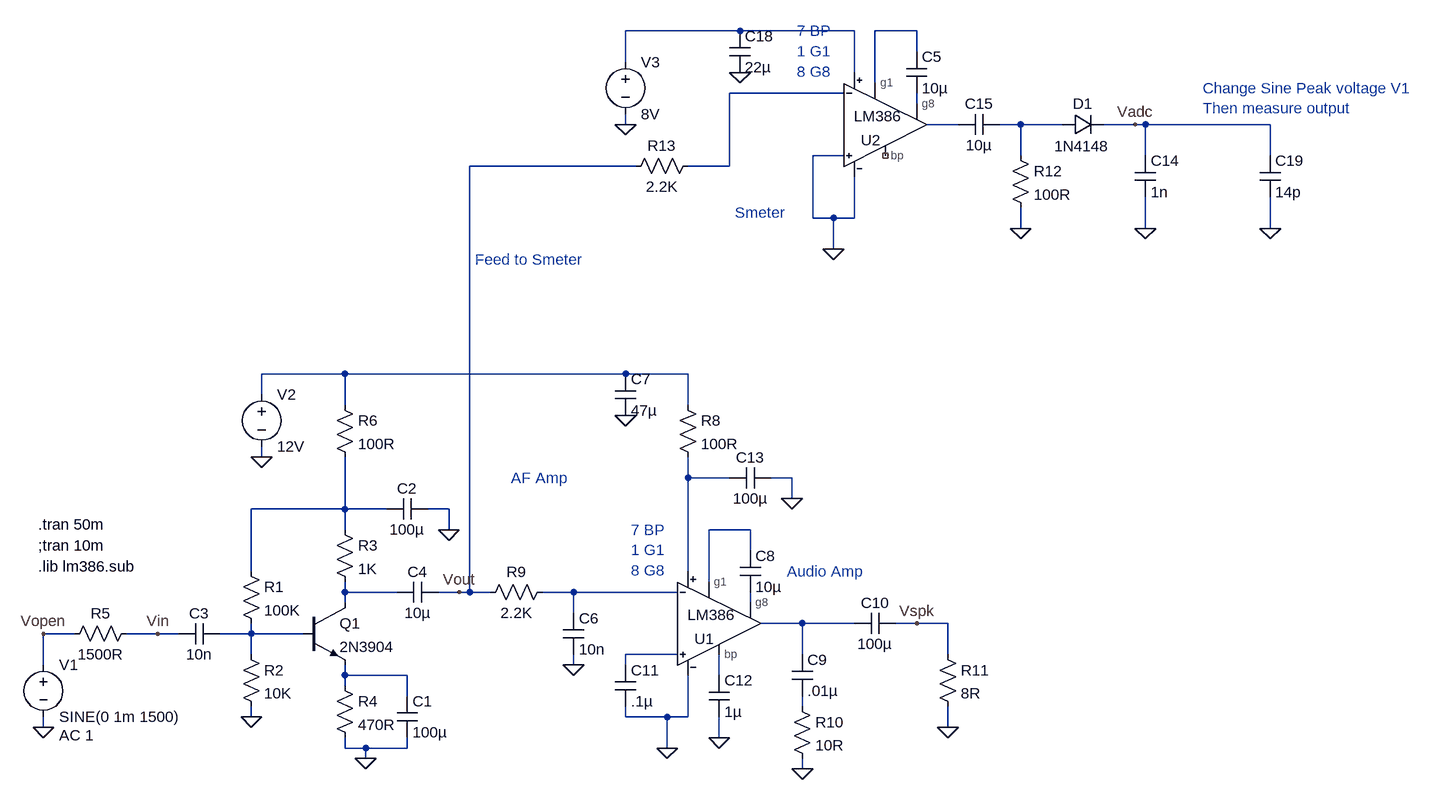
[diagram p0: schematic SMeter Detector LM386.asc]
SMeter Detector LM386.asc, the LTspice schematic file:
Version 4
SHEET 1 2204 680
WIRE 832 -752 656 -752
WIRE 1008 -752 832 -752
WIRE 1104 -752 1040 -752
WIRE 832 -736 832 -752
WIRE 1104 -720 1104 -752
WIRE 656 -704 656 -752
WIRE 1008 -688 1008 -752
WIRE 1040 -672 1040 -752
WIRE 992 -656 816 -656
WIRE 1104 -640 1104 -656
WIRE 656 -608 656 -624
WIRE 1168 -608 1120 -608
WIRE 1264 -608 1232 -608
WIRE 1328 -608 1264 -608
WIRE 1440 -608 1392 -608
WIRE 1456 -608 1440 -608
WIRE 1648 -608 1456 -608
WIRE 992 -560 944 -560
WIRE 1264 -560 1264 -608
WIRE 1456 -560 1456 -608
WIRE 1648 -560 1648 -608
WIRE 672 -544 416 -544
WIRE 816 -544 816 -656
WIRE 816 -544 752 -544
WIRE 944 -464 944 -560
WIRE 976 -464 944 -464
WIRE 1008 -464 1008 -528
WIRE 1008 -464 976 -464
WIRE 1264 -448 1264 -480
WIRE 1456 -448 1456 -496
WIRE 1648 -448 1648 -496
WIRE 976 -416 976 -464
WIRE 224 -224 96 -224
WIRE 656 -224 224 -224
WIRE 752 -224 656 -224
WIRE 656 -208 656 -224
WIRE 96 -192 96 -224
WIRE 224 -176 224 -224
WIRE 752 -176 752 -224
WIRE 96 -96 96 -112
WIRE 752 -64 752 -96
WIRE 816 -64 752 -64
WIRE 912 -64 880 -64
WIRE 912 -32 912 -64
WIRE 224 -16 224 -96
WIRE 224 -16 80 -16
WIRE 288 -16 224 -16
WIRE 384 -16 352 -16
WIRE 224 16 224 -16
WIRE 384 16 384 -16
WIRE 848 16 784 16
WIRE 848 48 848 16
WIRE 80 80 80 -16
WIRE 752 80 752 -64
WIRE 784 96 784 16
WIRE 224 112 224 96
WIRE 304 112 224 112
WIRE 400 112 368 112
WIRE 416 112 416 -544
WIRE 416 112 400 112
WIRE 448 112 416 112
WIRE 576 112 528 112
WIRE 736 112 576 112
WIRE 224 128 224 112
WIRE 848 128 848 112
WIRE 576 144 576 112
WIRE 928 160 864 160
WIRE 1008 160 928 160
WIRE 1104 160 1072 160
WIRE 1152 160 1104 160
WIRE -192 176 -240 176
WIRE -64 176 -112 176
WIRE -32 176 -64 176
WIRE 80 176 80 160
WIRE 80 176 32 176
WIRE 160 176 80 176
WIRE 80 208 80 176
WIRE 736 208 656 208
WIRE 928 208 928 160
WIRE 1152 208 1152 160
WIRE -240 224 -240 176
WIRE 576 224 576 208
WIRE 656 224 656 208
WIRE 224 240 224 224
WIRE 320 240 224 240
WIRE 800 240 800 208
WIRE 224 256 224 240
WIRE 320 272 320 240
WIRE 928 288 928 272
WIRE 80 304 80 288
WIRE 656 304 656 288
WIRE 720 304 656 304
WIRE 752 304 752 240
WIRE 752 304 720 304
WIRE -240 320 -240 304
WIRE 1152 320 1152 288
WIRE 800 336 800 304
WIRE 224 352 224 336
WIRE 256 352 224 352
WIRE 320 352 320 336
WIRE 320 352 256 352
WIRE 720 352 720 304
WIRE 256 368 256 352
WIRE 928 384 928 368
FLAG 96 -96 0
FLAG -240 320 0
FLAG 80 304 0
FLAG 256 368 0
FLAG 384 16 0
FLAG -240 176 Vopen
FLAG -64 176 Vin
FLAG 400 112 Vout
FLAG 576 224 0
FLAG 656 -160 0
FLAG 720 352 0
FLAG 928 384 0
FLAG 1152 320 0
FLAG 1104 160 Vspk
FLAG 800 336 0
FLAG 912 -32 0
FLAG 976 -416 0
FLAG 1456 -448 0
FLAG 656 -608 0
FLAG 832 -688 0
FLAG 1648 -448 0
FLAG 1440 -608 Vadc
FLAG 1264 -448 0
SYMBOL npn 160 128 R0
SYMATTR InstName Q1
SYMATTR Value 2N3904
SYMBOL res 64 64 R0
SYMATTR InstName R1
SYMATTR Value 100K
SYMBOL res 64 192 R0
SYMATTR InstName R2
SYMATTR Value 10K
SYMBOL res 208 0 R0
SYMATTR InstName R3
SYMATTR Value 1K
SYMBOL res 208 240 R0
SYMATTR InstName R4
SYMATTR Value 470R
SYMBOL cap 304 272 R0
SYMATTR InstName C1
SYMATTR Value 100µ
SYMBOL cap 352 -32 R90
WINDOW 0 0 32 VBottom 2
WINDOW 3 32 32 VTop 2
SYMATTR InstName C2
SYMATTR Value 100µ
SYMBOL cap 32 160 R90
WINDOW 0 0 32 VBottom 2
WINDOW 3 32 32 VTop 2
SYMATTR InstName C3
SYMATTR Value 10n
SYMBOL voltage -240 208 R0
WINDOW 123 24 124 Left 2
WINDOW 39 0 0 Left 2
SYMATTR Value2 AC 1
SYMATTR InstName V1
SYMATTR Value SINE(0 1m 1500)
SYMBOL voltage 96 -208 R0
WINDOW 123 0 0 Left 2
WINDOW 39 0 0 Left 2
SYMATTR InstName V2
SYMATTR Value 12V
SYMBOL res -96 160 R90
WINDOW 0 0 56 VBottom 2
WINDOW 3 32 56 VTop 2
SYMATTR InstName R5
SYMATTR Value 1500R
SYMBOL res 208 -192 R0
SYMATTR InstName R6
SYMATTR Value 100R
SYMBOL cap 368 96 R90
WINDOW 0 0 32 VBottom 2
WINDOW 3 32 32 VTop 2
SYMATTR InstName C4
SYMATTR Value 10µ
SYMBOL LM386 800 160 R0
WINDOW 3 -49 -13 Left 2
WINDOW 0 -38 24 Left 2
SYMATTR InstName U1
SYMBOL cap 560 144 R0
SYMATTR InstName C6
SYMATTR Value 10n
SYMBOL cap 640 -224 R0
SYMATTR InstName C7
SYMATTR Value 47µ
SYMBOL cap 832 48 R0
SYMATTR InstName C8
SYMATTR Value 10µ
SYMBOL res 544 96 R90
WINDOW 0 0 56 VBottom 2
WINDOW 3 32 56 VTop 2
SYMATTR InstName R9
SYMATTR Value 2.2K
SYMBOL cap 912 208 R0
SYMATTR InstName C9
SYMATTR Value .01µ
SYMBOL res 912 272 R0
SYMATTR InstName R10
SYMATTR Value 10R
SYMBOL cap 1072 144 R90
WINDOW 0 0 32 VBottom 2
WINDOW 3 32 32 VTop 2
SYMATTR InstName C10
SYMATTR Value 100µ
SYMBOL res 1136 192 R0
SYMATTR InstName R11
SYMATTR Value 8R
SYMBOL cap 640 224 R0
SYMATTR InstName C11
SYMATTR Value .1µ
SYMBOL cap 784 240 R0
SYMATTR InstName C12
SYMATTR Value 1µ
SYMBOL cap 880 -80 R90
WINDOW 0 0 32 VBottom 2
WINDOW 3 32 32 VTop 2
SYMATTR InstName C13
SYMATTR Value 100µ
SYMBOL res 736 -192 R0
SYMATTR InstName R8
SYMATTR Value 100R
SYMBOL LM386 1056 -608 R0
WINDOW 3 -49 -13 Left 2
WINDOW 0 -38 24 Left 2
SYMATTR InstName U2
SYMBOL cap 1088 -720 R0
SYMATTR InstName C5
SYMATTR Value 10µ
SYMBOL cap 1232 -624 R90
WINDOW 0 0 32 VBottom 2
WINDOW 3 32 32 VTop 2
SYMATTR InstName C15
SYMATTR Value 10µ
SYMBOL voltage 656 -720 R0
WINDOW 123 0 0 Left 2
WINDOW 39 0 0 Left 2
SYMATTR InstName V3
SYMATTR Value 8V
SYMBOL cap 816 -752 R0
SYMATTR InstName C18
SYMATTR Value 22µ
SYMBOL diode 1328 -592 R270
WINDOW 0 32 32 VTop 2
WINDOW 3 -2 30 VBottom 2
SYMATTR InstName D1
SYMATTR Value 1N4148
SYMBOL cap 1440 -560 R0
SYMATTR InstName C14
SYMATTR Value 1n
SYMBOL cap 1632 -560 R0
SYMATTR InstName C19
SYMATTR Value 14p
SYMBOL res 1248 -576 R0
SYMATTR InstName R12
SYMATTR Value 100R
SYMBOL res 768 -560 R90
WINDOW 0 0 56 VBottom 2
WINDOW 3 32 56 VTop 2
SYMATTR InstName R13
SYMATTR Value 2.2K
TEXT -248 40 Left 2 !;tran 10m
TEXT -248 72 Left 2 !.lib lm386.sub
TEXT 664 16 Left 2 ;7 BP\n1 G1\n8 G8
TEXT -248 8 Left 2 !.tran 50m
TEXT 920 -752 Left 2 ;7 BP\n1 G1\n8 G8
TEXT 904 80 Left 2 ;Audio Amp
TEXT 824 -472 Left 2 ;Smeter
TEXT 424 -400 Left 2 ;Feed to Smeter
TEXT 480 -64 Left 2 ;AF Amp
TEXT 1544 -664 Left 2 ;Change Sine Peak voltage V1\nThen measure output

The netlist it stands for:
* SMeter Detector LM386.asc
Q1 N011 N015 N017 0 2N3904
R1 N009 N015 100K
R2 N015 0 10K
R3 N009 N011 1K
R4 N017 0 470R
C1 N017 0 100µ
C2 0 N009 100µ
C3 N015 Vin 10n
V1 Vopen 0 SINE(0 1m 1500) AC 1
V2 N007 0 12V
R5 Vin Vopen 1500R
R6 N007 N009 100R
C4 Vout N011 10µ
XU1 N010 N012 N016 0 N014 N008 N018 N013 LM386 LM386  ; pins g1 In- In+ V- OUT V+ bp g8
C6 N012 0 10n
C7 N007 0 47µ
C8 N010 N013 10µ
R9 N012 Vout 2.2K
C9 N014 N019 .01µ
R10 N019 0 10R
C10 Vspk N014 100µ
R11 Vspk 0 8R
C11 N016 0 .1µ
C12 N018 0 1µ
C13 0 N008 100µ
R8 N007 N008 100R
XU2 N002 N003 0 0 N005 N001 NC_01 N004 LM386 LM386  ; pins g1 In- In+ V- OUT V+ bp g8
C5 N002 N004 10µ
C15 N006 N005 10µ
V3 N001 0 8V
C18 N001 0 22µ
D1 N006 Vadc 1N4148
C14 Vadc 0 1n
C19 Vadc 0 14p
R12 N006 0 100R
R13 N003 Vout 2.2K
.model D D
.lib standard.dio
.model NPN NPN
.model PNP PNP
.lib standard.bjt
;tran 10m
.lib lm386.sub
* 7 BP
* 1 G1
* 8 G8
.tran 50m
* 7 BP
* 1 G1
* 8 G8
* Audio Amp
* Smeter
* Feed to Smeter
* AF Amp
* Change Sine Peak voltage V1
* Then measure output
.lib LM386.sub
.backanno
.end